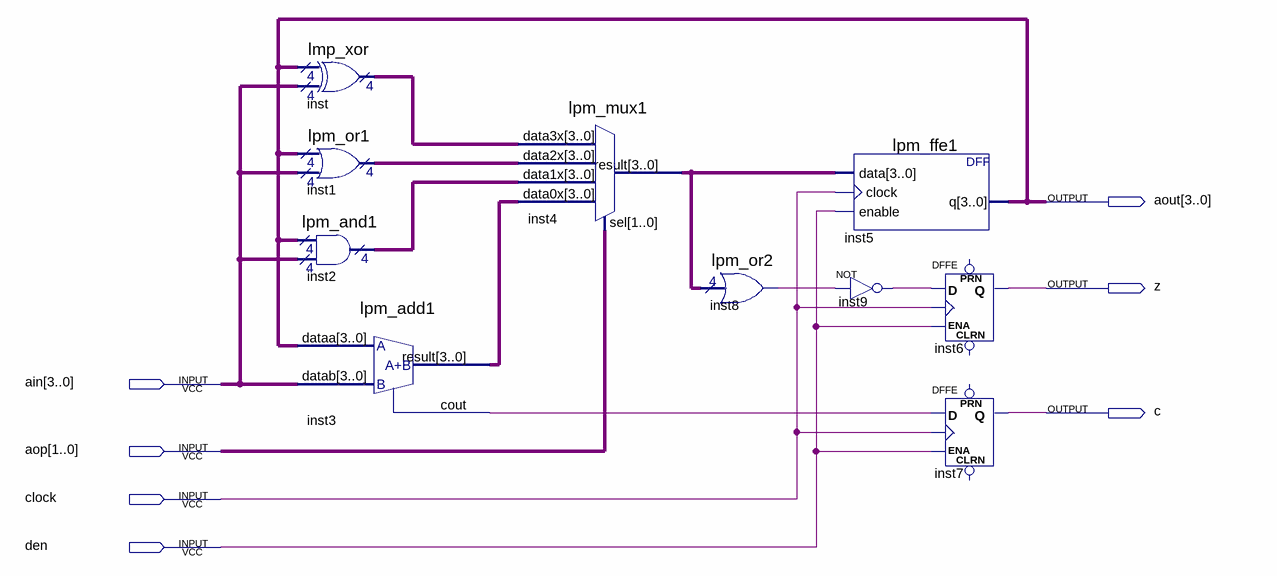
[diagram p0: schematic sheet]
// Quartus schematic apu.bdf as structural Verilog: 10 symbols, 7 pins
module apu (
  input  [3:0] ain,
  input  [1:0] aop,
  input  clock,
  input  den,
  output [3:0] aout,
  output z,
  output c
);

  wire inst3_cout, inst8_result, inst9_out;
  wire [3:0] inst1_result, inst2_result, inst3_result, inst4_result, inst_result;

  lmp_xor inst (.data0x(aout), .data1x(ain), .result(inst_result));
  lpm_or1 inst1 (.data0x(aout), .data1x(ain), .result(inst1_result));
  lpm_and1 inst2 (.data0x(aout), .data1x(ain), .result(inst2_result));
  lpm_add1 inst3 (.dataa(aout), .datab(ain), .result(inst3_result), .cout(inst3_cout));
  lpm_mux1 inst4 (
    .data3x(inst_result), .data2x(inst1_result), .data1x(inst2_result), .data0x(inst3_result), .sel(aop),
    .result(inst4_result));
  lpm_or2 inst8 (.data(inst4_result), .result(inst8_result));
  lpm_ffe1 inst5 (.data(inst4_result), .clock(clock), .enable(den), .q(aout));
  not inst9 (inst9_out, inst8_result);
  DFFE inst6 (.D(inst9_out), .CLK(clock), .ENA(den), .Q(z));  // open: PRN, CLRN
  DFFE inst7 (.D(inst3_cout), .CLK(clock), .ENA(den), .Q(c));  // open: PRN, CLRN
endmodule
